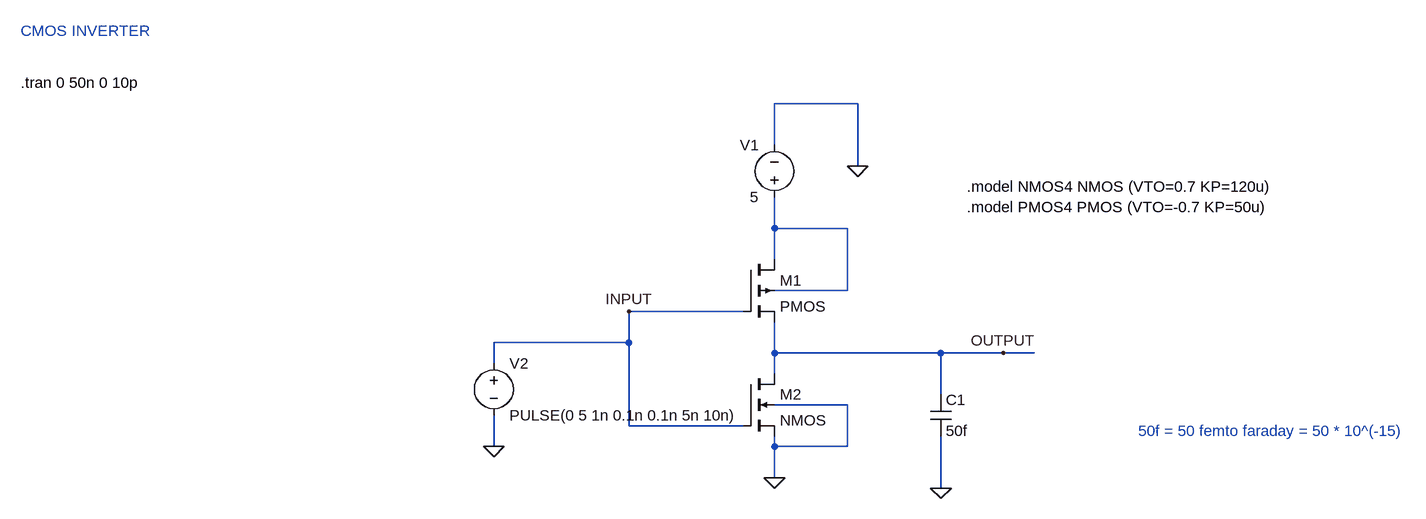
[diagram p0: schematic CMOS_inverter.asc]
CMOS_inverter.asc, the LTspice schematic file:
Version 4.1
SHEET 1 1256 680
WIRE 352 -192 224 -192
WIRE 224 -128 224 -192
WIRE 352 -96 352 -192
WIRE 224 0 224 -48
WIRE 336 0 224 0
WIRE 224 48 224 0
WIRE 336 96 336 0
WIRE 336 96 224 96
WIRE 176 128 0 128
WIRE 0 176 0 128
WIRE 0 176 -208 176
WIRE 224 192 224 144
WIRE 480 192 224 192
WIRE 576 192 480 192
WIRE 624 192 576 192
WIRE -208 208 -208 176
WIRE 224 224 224 192
WIRE 480 256 480 192
WIRE 336 272 224 272
WIRE 0 304 0 176
WIRE 176 304 0 304
WIRE -208 336 -208 288
WIRE 224 336 224 320
WIRE 336 336 336 272
WIRE 336 336 224 336
WIRE 224 384 224 336
WIRE 480 400 480 320
FLAG 224 384 0
FLAG 352 -96 0
FLAG 576 192 OUTPUT
FLAG 0 128 INPUT
FLAG -208 336 0
FLAG 480 400 0
SYMBOL pmos4 176 48 R0
SYMATTR InstName M1
SYMATTR Value2 l=1u w=40u
SYMBOL nmos4 176 224 R0
SYMATTR InstName M2
SYMATTR Value2 l=1u w=40u
SYMBOL voltage 224 -32 R180
WINDOW 0 24 96 Left 2
WINDOW 3 24 16 Left 2
WINDOW 123 0 0 Left 0
WINDOW 39 0 0 Left 0
SYMATTR InstName V1
SYMATTR Value 5
SYMBOL voltage -208 192 R0
WINDOW 123 0 0 Left 0
WINDOW 39 0 0 Left 0
SYMATTR InstName V2
SYMATTR Value PULSE(0 5 1n 0.1n 0.1n 5n 10n)
SYMBOL cap 464 256 R0
SYMATTR InstName C1
SYMATTR Value 50f
TEXT -936 -224 Left 2 !.tran 0 50n 0 10p
TEXT -936 -304 Left 2 ;CMOS INVERTER
TEXT 784 312 Left 2 ;50f = 50 femto faraday = 50 * 10^(-15)
TEXT 520 -64 Left 2 !.model NMOS4 NMOS (VTO=0.7 KP=120u)\n.model PMOS4 PMOS (VTO=-0.7 KP=50u)

The netlist it stands for:
* CMOS_inverter.asc
M1 N001 INPUT OUTPUT N001 PMOS l=1u w=40u
M2 OUTPUT INPUT 0 0 NMOS l=1u w=40u
V1 N001 0 5
V2 INPUT 0 PULSE(0 5 1n 0.1n 0.1n 5n 10n)
C1 OUTPUT 0 50f
.model NMOS NMOS
.model PMOS PMOS
.lib standard.mos
.tran 0 50n 0 10p
* CMOS INVERTER
* 50f = 50 femto faraday = 50 * 10^(-15)
.model NMOS4 NMOS (VTO=0.7 KP=120u)
.model PMOS4 PMOS (VTO=-0.7 KP=50u)
.backanno
.end

* Results of the author's LTspice run, read from the files saved beside the schematic
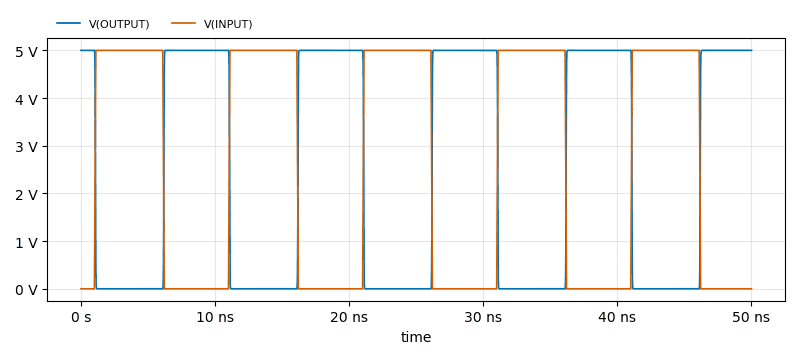
[diagram p1: Transient Analysis of CMOS_inverter.asc, plotted from the saved traces]
* Transient Analysis, 1 run:
*   V(OUTPUT): min 0 V, max 5 V, average 2.45 V, rms 3.491 V, last 5 V
*   V(INPUT): min 0 V, max 5 V, average 2.55 V, rms 3.559 V, last 0 V